# Altium project Rat Social Box Extension.PrjPcb
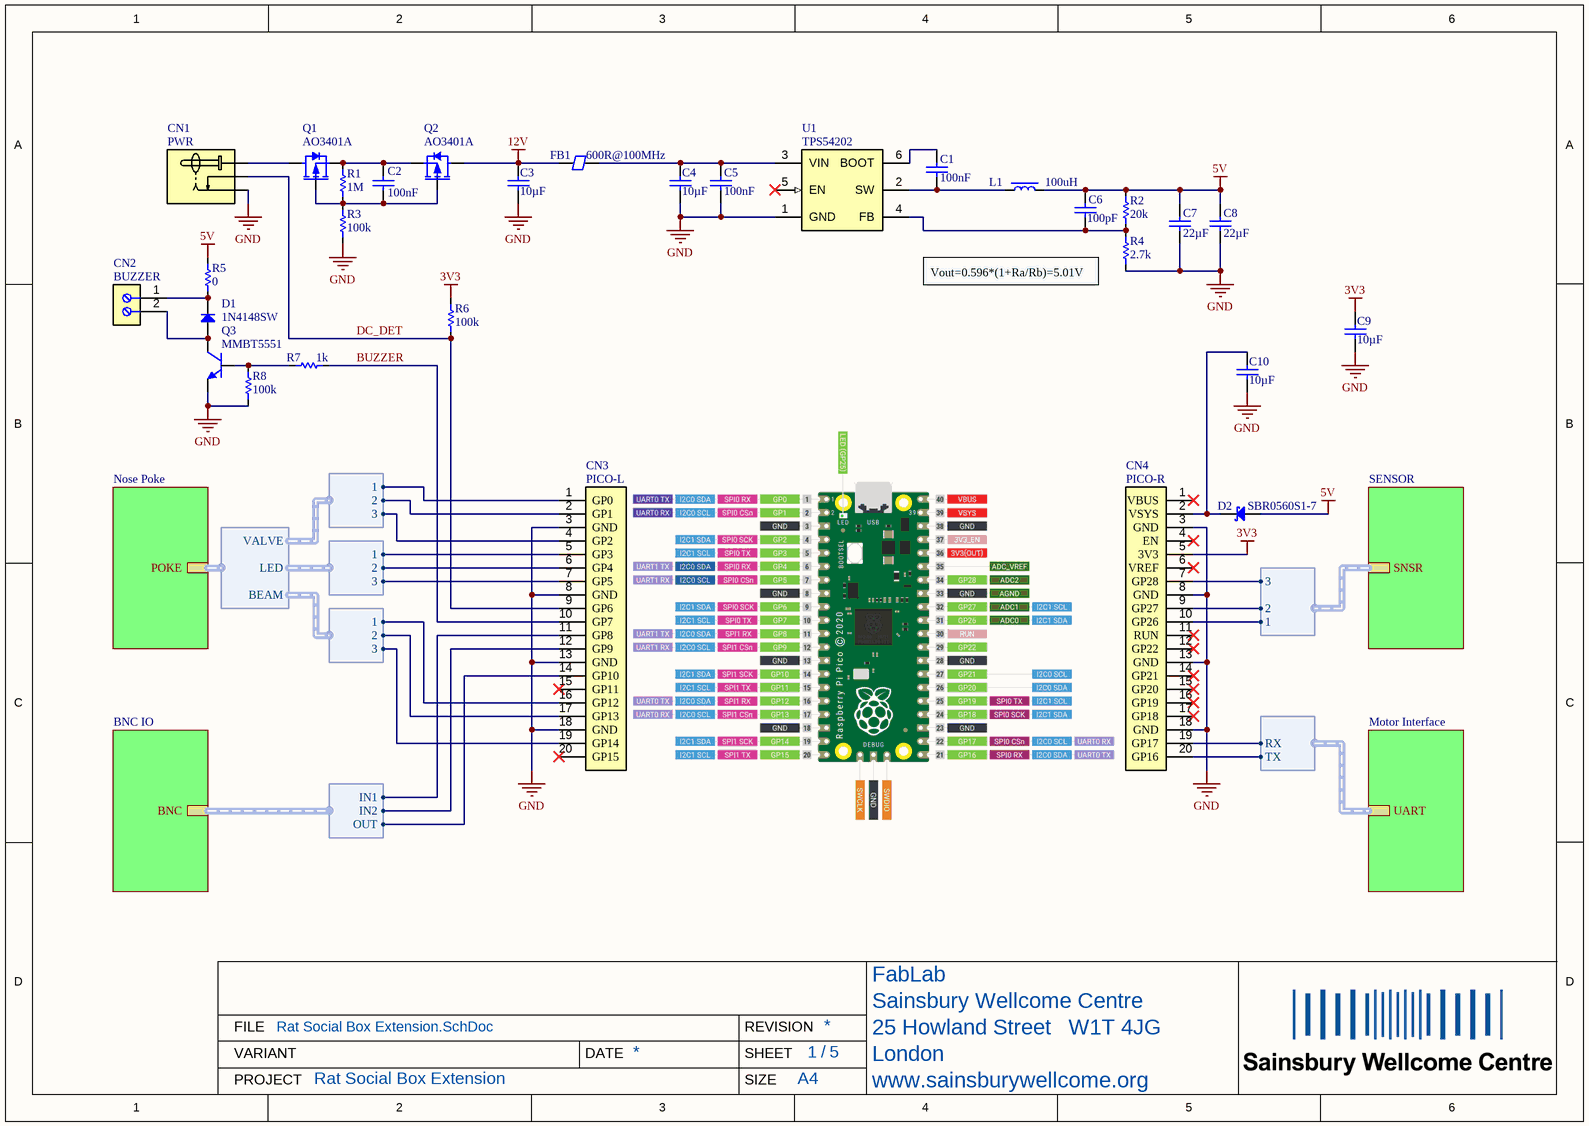
[diagram p0: Rat Social Box Extension.SchDoc]
Project: Rat Social Box Extension
5 sheets, 101 parts. Net scope: hierarchical (ports join the sheet entries above them; power ports are global).
Board file: Rat Social Box Extension.PcbDoc
Sheets:
  Rat Social Box Extension.SchDoc
    SENSOR = Sensor.SchDoc
    Motor Interface = Motor Interface.SchDoc
    Nose Poke = Nose Poke.SchDoc
    BNC IO = BNC IO.SchDoc

## Sheet Rat Social Box Extension.SchDoc
size 297 x 209 mm; CompanyName: Sainsbury Wellcome Centre; Organization: FabLab; Address1: Sainsbury Wellcome Centre; Address2: 25 Howland Street; Address3: London; Address4: W1T 4JG; DocumentNumber: 1; SheetNumber: 1; SheetTotal: 5; swcgroup: FabLab; Org: Sainsbury Wellcome Centre; Add1: 25 Howland Street; Add2: London; Add3: W1T 4JG; WebAddress: www.sainsburywellcome.org; SheetSize: A4; SheetName: Rat Social Box Extension

### Parts
C1  value 100nF  [CAP_CHIP_0603]  (hidden comment: C0603-100nF-50V)
C2  value 100nF  [CAP_CHIP_0603]  (hidden comment: C0603-100nF-50V)
C3  value 10µF  [CAP_CHIP_0603]  (hidden comment: C0603-10uF-25V)
C4  value 10µF  [CAP_CHIP_0603]  (hidden comment: C0603-10uF-25V)
C5  value 100nF  [CAP_CHIP_0603]  (hidden comment: C0603-100nF-50V)
C6  value 100pF  [CAP_CHIP_0603]  (hidden comment: C0603-100pF-50V)
C7  value 22µF  [CAP_CHIP_0603]  (hidden comment: C0603-22uF-6V3)
C8  value 22µF  [CAP_CHIP_0603]  (hidden comment: C0603-22uF-6V3)
C9  value 10µF  [CAP_CHIP_0603]  (hidden comment: C0603-10uF-25V)
C10  value 10µF  [CAP_CHIP_0603]  (hidden comment: C0603-10uF-25V)
CN1  PWR  [DC-005-2.0]
CN2  BUZZER  [TH-5.00-1X2P]
CN3  PICO-L  [FM_2.54_1X20P]
CN4  PICO-R  [FM_2.54_1X20P]
D1  1N4148SW  [SOD323]
D2  SBR0560S1-7  [SOD123]
FB1  value 600R@100MHz  [FB_CHIP_0805]  (hidden comment: FB0805-600R-0.5A)
L1  value 100uH  [IND_PWR_0402L]  (hidden comment: L-PWR-100uH-0.26A)
Q1  AO3401A  [SOT23]
Q2  AO3401A  [SOT23]
Q3  MMBT5551  [SOT23]
R1  value 1M  [RES_CHIP_0603]  (hidden comment: R0603-1M)
R2  value 20k  [RES_CHIP_0603]  (hidden comment: R0603-20K)
R3  value 100k  [RES_CHIP_0603]  (hidden comment: R0603-100K)
R4  value 2.7k  [RES_CHIP_0603]  (hidden comment: R0603-2K7)
R5  value 0  [RES_CHIP_1206]  (hidden comment: R1206-0R)
R6  value 100k  [RES_CHIP_0603]  (hidden comment: R0603-100K)
R7  value 1k  [RES_CHIP_0603]  (hidden comment: R0603-1K)
R8  value 100k  [RES_CHIP_0603]  (hidden comment: R0603-100K)
U1  TPS54202  [SOT23-6]

### Sub-sheets
BNC IO = BNC IO.SchDoc: BNC (harness BNC)
Motor Interface = Motor Interface.SchDoc: UART (harness UART)
Nose Poke = Nose Poke.SchDoc: POKE (harness POKE)
SENSOR = Sensor.SchDoc: SNSR (harness SNSR)

### Harnesses
UART: TX, RX
SNSR: 3, 2, 1
POKE: VALVE, LED, BEAM
VALVE: 1, 2, 3
LED: 1, 2, 3
BEAM: 1, 2, 3
BNC: IN1, IN2, OUT

### Nets
3V3: C9.2 CN4.5(3V3) R6.2
5V: C6.2 C7.2 C8.2 D2.2(A) L1.2 R2.2 R5.2
12V: C3.2 FB1.1 Q2.3(D)
GND: C3.1 C4.1 C5.1 C7.1 C8.1 C9.1 C10.1 CN1.2(Ring) CN3.3(GND) CN3.8(GND) CN3.13(GND) CN3.18(GND) CN4.3(GND) CN4.8(GND) CN4.13(GND) CN4.18(GND) Q3.2(E) R3.1 R4.1 R8.1 U1.1(GND)
BNC.IN1: CN3.11(GP8) ; sheet BNC IO/BNC.IN1
BNC.IN2: CN3.12(GP9) ; sheet BNC IO/BNC.IN2
BNC.OUT: CN3.14(GP10) ; sheet BNC IO/BNC.OUT
BUZZER: CN3.10(GP7) R7.2
DC_DET: CN1.3(Detect) CN3.9(GP6) R6.1
POKE.BEAM.1: CN3.16(GP12) ; harness BEAM.1
POKE.BEAM.2: CN3.17(GP13) ; harness BEAM.2
POKE.BEAM.3: CN3.19(GP14) ; harness BEAM.3
POKE.LED.1: CN3.5(GP3) ; harness LED.1
POKE.LED.2: CN3.6(GP4) ; harness LED.2
POKE.LED.3: CN3.7(GP5) ; harness LED.3
POKE.VALVE.1: CN3.1(GP0) ; harness VALVE.1
POKE.VALVE.2: CN3.2(GP1) ; harness VALVE.2
POKE.VALVE.3: CN3.4(GP2) ; harness VALVE.3
SNSR.1: CN4.10(GP26) ; sheet SENSOR/SNSR.1
SNSR.2: CN4.9(GP27) ; sheet SENSOR/SNSR.2
SNSR.3: CN4.7(GP28) ; sheet SENSOR/SNSR.3
NetC1_1: C1.1 L1.1 U1.2(SW)
NetC1_2: C1.2 U1.6(BOOT)
NetC2_1: C2.1 Q1.1(G) Q2.1(G) R1.1 R3.2
NetC2_2: C2.2 Q1.2(S) Q2.2(S) R1.2
NetC4_2: C4.2 C5.2 FB1.2 U1.3(VIN)
NetC6_1: C6.1 R2.1 R4.2 U1.4(FB)
NetC10_2: C10.2 CN4.2(VSYS) D2.1(C)
NetCN1_1: CN1.1(Center) Q1.3(D)
NetCN2_1: CN2.1 D1.1(K) R5.1
NetCN2_2: CN2.2 D1.2(A) Q3.3(C)
NetCN4_19: CN4.19(GP17) ; sheet Motor Interface/UART.RX
NetCN4_20: CN4.20(GP16) ; sheet Motor Interface/UART.TX
NetQ3_1: Q3.1(B) R7.1 R8.2

Not connected (* = marked no-connect by the designer): CN3 15(GP11)* 20(GP15)*; CN4 1(VBUS)* 4(EN)* 6(VREF)* 11(RUN)* 12(GP22)* 14(GP21)* 15(GP20)* 16(GP19)* 17(GP18)*; U1 5(EN)*

### Notes on the sheet
- Vout=0.596*(1+Ra/Rb)=5.01V
- FILE
- VARIANT
- DATE
- REVISION
- SHEET
- /
- PROJECT
- SIZE

### Library data of the parts
C1 C5 = CMP-611-0027-24: 0603 Multilayer Ceramic Capacitors MLCC; PartNumber: CC0603KRX7R9BB104; Tolerance: 10%; Pick&PlaceFootprint: C0603; Dielectric: X7R; Voltage Rating: 50V; Capacitor Type: Ceramic; RoHS: Yes; Mount: SMD; LCSC Part N.: C14663; Case/Package: 0603
C2 = CMP-611-0027-24: 0603 Multilayer Ceramic Capacitors MLCC; PartNumber: CC0603KRX7R9BB104; Pick&PlaceFootprint: C0603; Dielectric: X7R; Voltage Rating: 50V; Tolerance: 10%; Case/Package: 0603; Capacitor Type: Ceramic; LCSC Part N.: C14663; Mount: SMD; RoHS: Yes
C3 C4 C9 C10 = CMP-611-0050-6: 0603 Multilayer Ceramic Capacitors MLCC; PartNumber: CL10A106MA8NRNC; Dielectric: X5R; Pick&PlaceFootprint: C0603; Voltage Rating: 25V; Tolerance: 20%; Case/Package: 0603; LCSC Part N.: C96446; RoHS: Yes; Capacitor Type: Ceramic; Mount: SMD
C6 = CMP-611-0038-6: 0603 Multilayer Ceramic Capacitors MLCC; PartNumber: CL10C101JB8NNNC; Pick&PlaceFootprint: C0603; Tolerance: 5%; Voltage Rating: 50V; Dielectric: C0G; Case/Package: 0603; LCSC Part N.: C14858; Capacitor Type: Ceramic; Mount: SMD; RoHS: Yes
C7 C8 = CMP-611-0054-4: 0603 Multilayer Ceramic Capacitors MLCC; PartNumber: CL10A226MQ8NRNC; Pick&PlaceFootprint: C0603; Dielectric: X5R; Voltage Rating: 6.3V; Tolerance: 20%; RoHS: Yes; Mount: SMD; Case/Package: 0603; Capacitor Type: Ceramic; LCSC Part N.: C59461
CN1 = CMP-360-0005-6: Surface Mount, Right Angle 2.5A 24V SMD DC Power Connector; PartNumber: DC-005-2.5A-2.0-SMT; Connector Type: Jack,Power; Pitch: 2.0mm; Gender: Male; Contact Plating: Tin; Voltage Rating: 24V; Contact Material: Copper Alloy; Current Rating: 2.5A; Mount: Surface Mount; LCSC Part N.: C2880543; Orientation: Horizontal
CN2 = CMP-00028-6: 1x2P 20A -40℃~+105℃ 250V Green 12~22 Direct Insert 5mm 2.5 1 2 Plugin,P=5mm Screw Terminal Blocks; PartNumber: WJ128V-5.0-2P; Gender: Male; Number of Positions: 2; Number of Rows: 1; LCSC Part N.: C8269; Pitch: 5mm; Mount: Thought Hole; Number of Contacts: 2; Orientation: Straight
CN3 CN4 = CMP-380-0017-2: 8.5mm Square Hole TH,P=2.54mm Female Headers; PartNumber: 22850120ANG1SYA01; Pitch: 2.54mm; Number of Positions: 20; Orientation: Straight; Gender: Female; Number of Contacts: 20; Number of Rows: 1; Mount: TH; LCSC Part N.: C429947
D1 = CMP-820-0007-2: 100V Single 1.25V@150mA 4ns 150mA SOD-323 Switching Diode; Forward Voltage: 1.25V; Mount: Surface Mount; Max Reverse Voltage: 100V; Pick&PlaceFootprint: SOD-323; Rectified Current: 150mA; LCSC Part N.: C2128; PartNumber: 1N4148SW
D2 = CMP-821-0014-2: Diode Schottky 60V 0.5A 2-Pin SOD-123 T/R; Rectified Current: 15A; Forward Voltage: 440mV; PartNumber: SBR0560S1-7; LCSC Part N.: C117950; Mount: Surface Mount; Max Reverse Voltage: 60V; Pick&PlaceFootprint: SOD123
FB1 = CMP-600-0000-6: Ferrite Chip, 1 Function(s), 0.5A, 2 Pin(s); PartNumber: GZ2012D601TF; DC Resistance-Max: 300mR; Current Rating: 500mA; Footprint: 0805; LCSC Part N.: C1017
L1 = CMP-620-0008-4: Inductor Power Shielded Wirewound 100uH 20% 100KHz Ferrite 450mA DCR 1515 Blister T/R; PartNumber: VLCF4020T-101MR26; Saturation Current: 260mA; DC Resistance (DCR): 1R4; LCSC Part N.: C20339; Tolerance: 20%; RMS Current (Irms): 450mA
Q1 Q2 = CMP-810-0003-2: 30V 4A 44mΩ@10V,4.3A 1.4W 1.3V@250uA 1 PChannel SOT-23-3L MOSFETs; RDS(ON): 44mR; Gate-Source Voltage (Vgs): 12V; Pick&PlaceFootprint: SOT-23; Drain Current (Id): -4A; Switching Time: 60ns; Drain-Source Voltage (Vds): -30V; Polarity: P Channel; Power Dissipation: 1.4W; LCSC Part N.: C15127; Mount: Surface Mount; PartNumber: AO3401A
Q3 = CMP-810-0000-7: 160V 300mW 200@10mA 5V 600mA NPN SOT-23 Bipolar Transistor; Collector-Base Voltage (VCBO): 180V; Transition Frequency: 100MHz; Emitter-Base Voltage  (VEBO): 6V; Power Dissipation: 300mW; Polarity: NPN; PartNumber: MMBT5551; Pick&PlaceFootprint: SOT-23; Collector Current (IC): 600mA; Mount: Surface Mount; LCSC Part N.: C2145; Collector-Emitter Voltage( VCEO): 160V
R1 = CMP-633-0066-20: 100mW Thick Film Resistors 75V ±100ppm/℃ ±1% 0603 Chip Resistor; PartNumber: 0603WAF1004T5E; Number of Resistors: 1; Pick&PlaceFootprint: R0603; Voltage Rating: 75V; Mount: Surface Mount; LCSC Part N.: C22935; Power Rating: 100mW; Tolerance: 1%; Case/Package: 0603
R2 = CMP-633-0126-1: 100mW Thick Film Resistors 75V ±100ppm/℃ ±1% 0603 Chip Resistor; PartNumber: 0603WAF2002T5E; Pick&PlaceFootprint: R0603; Number of Resistors: 1; Case/Package: 0603; Tolerance: 1%; Voltage Rating: 75V; Power Rating: 100mW; Mount: Surface Mount; LCSC Part N.: C4184
R3 R6 R8 = CMP-633-0000-28: 100mW Thick Film Resistors 75V ±100ppm/℃ ±1% 0603 Chip Resistor; PartNumber: 0603WAF1003T5E; Number of Resistors: 1; Pick&PlaceFootprint: R0603; LCSC Part N.: C25803; Mount: Surface Mount; Voltage Rating: 75V; Power Rating: 100mW; Case/Package: 0603; Tolerance: 1%
R4 = CMP-633-0031-25: 100mW Thick Film Resistors 75V ±100ppm/℃ ±1% 0603 Chip Resistor; PartNumber: 0603WAF2701T5E; Number of Resistors: 1; Pick&PlaceFootprint: R0603; Mount: Surface Mount; Power Rating: 100mW; Case/Package: 0603; Tolerance: 1%; Voltage Rating: 75V; LCSC Part N.: C13167
R5 = CMP-633-0050-10: 250mW Thick Film Resistors 200V ±800ppm/℃ ±1% 0Ω 1206 Chip Resistor; PartNumber: 1206W4F0000T5E; Number of Resistors: 1; Pick&PlaceFootprint: 1206; Tolerance: 1%; Power Rating: 250mW; Case/Package: 1206; Voltage Rating: 200V; LCSC Part N.: C17888; Mount: Surface Mount
R7 = CMP-633-0013-26: 100mW Thick Film Resistors 75V ±100ppm/℃ ±1% 0603 Chip Resistor; PartNumber: 0603WAF1001T5E; Pick&PlaceFootprint: R0603; Number of Resistors: 1; Voltage Rating: 75V; Case/Package: 0603; Tolerance: 1%; Mount: Surface Mount; LCSC Part N.: C21190; Power Rating: 100mW
U1 = CMP-970-0042-1: Switching Regulator, Current-mode, 2A, 500kHz Switching Freq-Max, PDSO6; PartNumber: TPS54202DDCR; Load Regulation: 0.1%; Max Output Voltage: 28V; Min Input Voltage: 4.5V; Switcher Configuration: BUCK; RDS(On): 148mR; Switching Frequency: 590kHz; Reference Voltage: 0.596V; Pick&PlaceFootprint: SOT23-6; Max Input Voltage: 28V; LCSC Part N.: C191884; Line Regulation: 0.1%; Max Output current: 2A

## Sheet Sensor.SchDoc
size 297 x 209 mm; CompanyName: Sainsbury Wellcome Centre; Organization: FabLab; Address1: Sainsbury Wellcome Centre; Address2: 25 Howland Street; Address3: London; Address4: W1T 4JG; DocumentNumber: 3; SheetNumber: 4; SheetTotal: 5; swcgroup: FabLab; Org: Sainsbury Wellcome Centre; Add1: 25 Howland Street; Add2: London; Add3: W1T 4JG; WebAddress: www.sainsburywellcome.org; SheetSize: A4; SheetName: Sensor
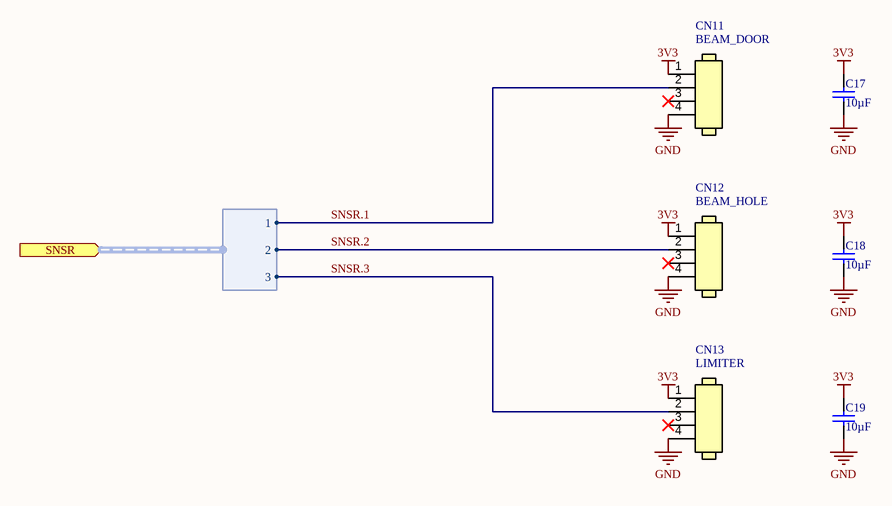
[diagram p1: Sensor.SchDoc]

### Parts
C17  value 10µF  [CAP_CHIP_0603]  (hidden comment: C0603-10uF-25V)
C18  value 10µF  [CAP_CHIP_0603]  (hidden comment: C0603-10uF-25V)
C19  value 10µF  [CAP_CHIP_0603]  (hidden comment: C0603-10uF-25V)
CN11  BEAM_DOOR  [MOLEX_1.25_R_DIP_4P]
CN12  BEAM_HOLE  [MOLEX_1.25_R_DIP_4P]
CN13  LIMITER  [MOLEX_1.25_R_DIP_4P]

### Ports
SNSR (in, harness SNSR)

### Harnesses
SNSR: 3, 2, 1

### Nets
3V3: C17.2 C18.2 C19.2 CN11.1 CN12.1 CN13.1
GND: C17.1 C18.1 C19.1 CN11.4 CN12.4 CN13.4
SNSR.1: CN11.2 ; port SNSR.1
SNSR.2: CN12.2 ; port SNSR.2
SNSR.3: CN13.2 ; port SNSR.3

Not connected (* = marked no-connect by the designer): CN11 3*; CN12 3*; CN13 3*

### Notes on the sheet
- FILE
- VARIANT
- DATE
- REVISION
- SHEET
- /
- PROJECT
- SIZE

### Library data of the parts
C17-C19 = CMP-611-0050-6: as C3 on sheet Rat Social Box Extension; Case/Package: 0603; LCSC Part N.: C96446; RoHS: Yes; Capacitor Type: Ceramic; Mount: SMD
CN11-CN13 = CMP-370-0050-2: Conn Shrouded Header (4 Sides) HDR 4 POS 1.25mm Solder RA Side Entry Thru-Hole PicoBlade™ Tray; PartNumber: 53048-0410; Number of Contacts: 4; Current Rating: 1A; Gender: Male; Pitch: 1.25mm; Orientation: Right Angle; Number of Rows: 1; Mount: Surface Mount; LCSC Part N.: C588275

## Sheet Motor Interface.SchDoc
size 297 x 209 mm; CompanyName: Sainsbury Wellcome Centre; Organization: FabLab; Address1: Sainsbury Wellcome Centre; Address2: 25 Howland Street; Address3: London; Address4: W1T 4JG; DocumentNumber: 5; SheetNumber: 5; SheetTotal: 5; swcgroup: FabLab; Org: Sainsbury Wellcome Centre; Add1: 25 Howland Street; Add2: London; Add3: W1T 4JG; WebAddress: www.sainsburywellcome.org; SheetSize: A4; SheetName: Motor Interface
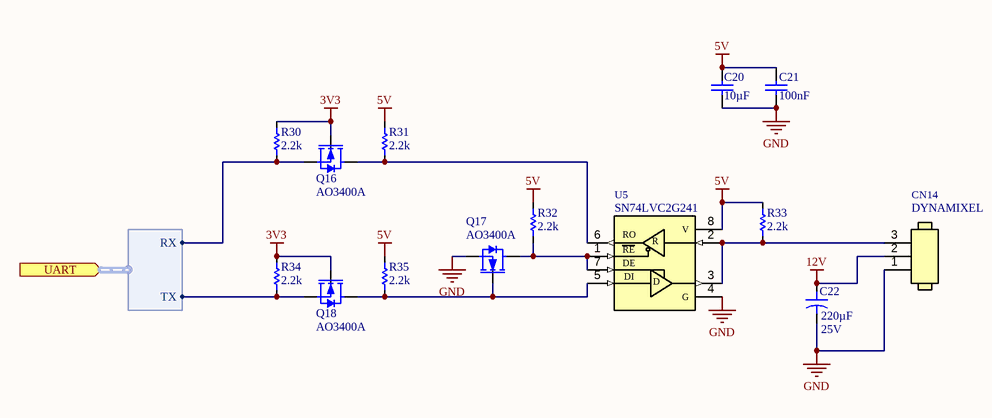
[diagram p2: Motor Interface.SchDoc]

### Parts
C20  value 10µF  [CAP_CHIP_0603]  (hidden comment: C0603-10uF-25V)
C21  value 100nF  [CAP_CHIP_0603]  (hidden comment: C0603-100nF-50V)
C22  value 220µF  Voltage Rating: 25V  [ECAP_SMD_6.3]  (hidden comment: SC63-220uF-25V)
CN14  DYNAMIXEL  [EH_90_1X3P]
Q16  AO3400A  [SOT23]
Q17  AO3400A  [SOT23]
Q18  AO3400A  [SOT23]
R30  value 2.2k  [RES_CHIP_0603]  (hidden comment: R0603-2K2)
R31  value 2.2k  [RES_CHIP_0603]  (hidden comment: R0603-2K2)
R32  value 2.2k  [RES_CHIP_0603]  (hidden comment: R0603-2K2)
R33  value 2.2k  [RES_CHIP_0603]  (hidden comment: R0603-2K2)
R34  value 2.2k  [RES_CHIP_0603]  (hidden comment: R0603-2K2)
R35  value 2.2k  [RES_CHIP_0603]  (hidden comment: R0603-2K2)
U5  SN74LVC2G241  [VSSOP8_2X2.3_0.5E]

### Ports
UART (in, harness UART)

### Harnesses
UART: TX, RX

### Nets
3V3: Q16.1(G) Q18.1(G) R30.2 R34.2
5V: C20.2 C21.2 R31.2 R32.2 R33.2 R35.2 U5.8(V)
12V: C22.1 CN14.2
GND: C20.1 C21.1 C22.2 CN14.1 Q17.2(S) U5.4(G)
NetCN4_19: Q16.2(S) R30.1 ; port UART.RX
NetCN4_20: Q18.2(S) R34.1 ; port UART.TX
NetCN14_3: CN14.3 R33.1 U5.2(1A) U5.3(B)
NetQ16_3: Q16.3(D) R31.1 U5.6(1Y)
NetQ17_1: Q17.1(G) Q18.3(D) R35.1 U5.5(D)
NetQ17_3: Q17.3(D) R32.1 U5.1(~{1OE}) U5.7(2OE)

### Notes on the sheet
- FILE
- VARIANT
- DATE
- REVISION
- SHEET
- /
- PROJECT
- SIZE
- (in symbol CMP-9C0-0006-1) RO; R; RE; DE; DI

### Library data of the parts
C20 = CMP-611-0050-6: as C3 on sheet Rat Social Box Extension; Case/Package: 0603; LCSC Part N.: C96446; RoHS: Yes; Capacitor Type: Ceramic; Mount: SMD
C21 = CMP-611-0027-24: as C1 on sheet Rat Social Box Extension; Capacitor Type: Ceramic; RoHS: Yes; Mount: SMD; LCSC Part N.: C14663; Case/Package: 0603
C22 = CMP-610-0003-4: 25V 220uF ±20% SMD,D6.3xL7.7mm Solid Capacitors; PartNumber: HV1E477M0810PZ; Pick&PlaceFootprint: EC63; ESR (Equivalent Series Resistance): 35mR; Mount: Surface Mount; RoHS: Yes; Capacitor Type: Solid; LCSC Part N.: C5246541; Tolerance: 20%
CN14 = CMP-370-0057-1: Conn Shrouded Header (3 Sides) HDR 3 POS 2.5mm Solder RA Side Entry Thru-Hole Box; PartNumber: S3B-EH(LF)(SN); Gender: Male; Number of Positions: 3; Current Rating: 3A; Mount: through hole; Orientation: Right Angle; LCSC Part N.: C263754; Pitch: 2.5mm; Contact Plating: Tin; Number of Rows: 1; Contact Material: Copper, Tin; Number of Contacts: 3
Q16-Q18 = CMP-810-0002-2: 30V 5.7A 26.5mΩ@10V,5.7A 1.4W 1.5V@250uA 1 NChannel SOT-23-3L MOSFETs; Gate-Source Voltage (Vgs): 12V; Pick&PlaceFootprint: SOT-23; RDS(ON): 26.5mR; Switching Time: 34.5ns; LCSC Part N.: C20917; Drain-Source Voltage (Vds): 30V; Mount: Surface Mount; PartNumber: AO3400A; Power Dissipation: 1.4W; Drain Current (Id): 5.7A; Polarity: N Channel
R30-R35 = CMP-633-0070-21: 100mW Thick Film Resistors 75V ±100ppm/℃ ±1% 0603 Chip Resistor; PartNumber: 0603WAF2201T5E; Pick&PlaceFootprint: R0603; Number of Resistors: 1; Power Rating: 100mW; Mount: Surface Mount; Voltage Rating: 75V; Tolerance: 1%; LCSC Part N.: C4190; Case/Package: 0603
U5 = CMP-9C0-0006-1: Buffer/Line Driver 2-CH Non-Inverting 3-ST CMOS 8-Pin VSSOP T/R; PartNumber: SN74LVC2G241DCUR; Max Supply Voltage: 5.5V; Number of Channels: 2; Low Level Output Current: 32mA; Min Supply Voltage: 1.65V; Turn-On Delay Time: 12.5ns; Pick&PlaceFootprint: VSSOP8; High Level Output Current: -32mA; LCSC Part N.: C10430

## Sheet Nose Poke.SchDoc
size 297 x 209 mm; CompanyName: Sainsbury Wellcome Centre; Organization: FabLab; Address1: Sainsbury Wellcome Centre; Address2: 25 Howland Street; Address3: London; Address4: W1T 4JG; DocumentNumber: 2; SheetNumber: 3; SheetTotal: 5; swcgroup: FabLab; Org: Sainsbury Wellcome Centre; Add1: 25 Howland Street; Add2: London; Add3: W1T 4JG; WebAddress: www.sainsburywellcome.org; SheetSize: A4; SheetName: Nose Poke
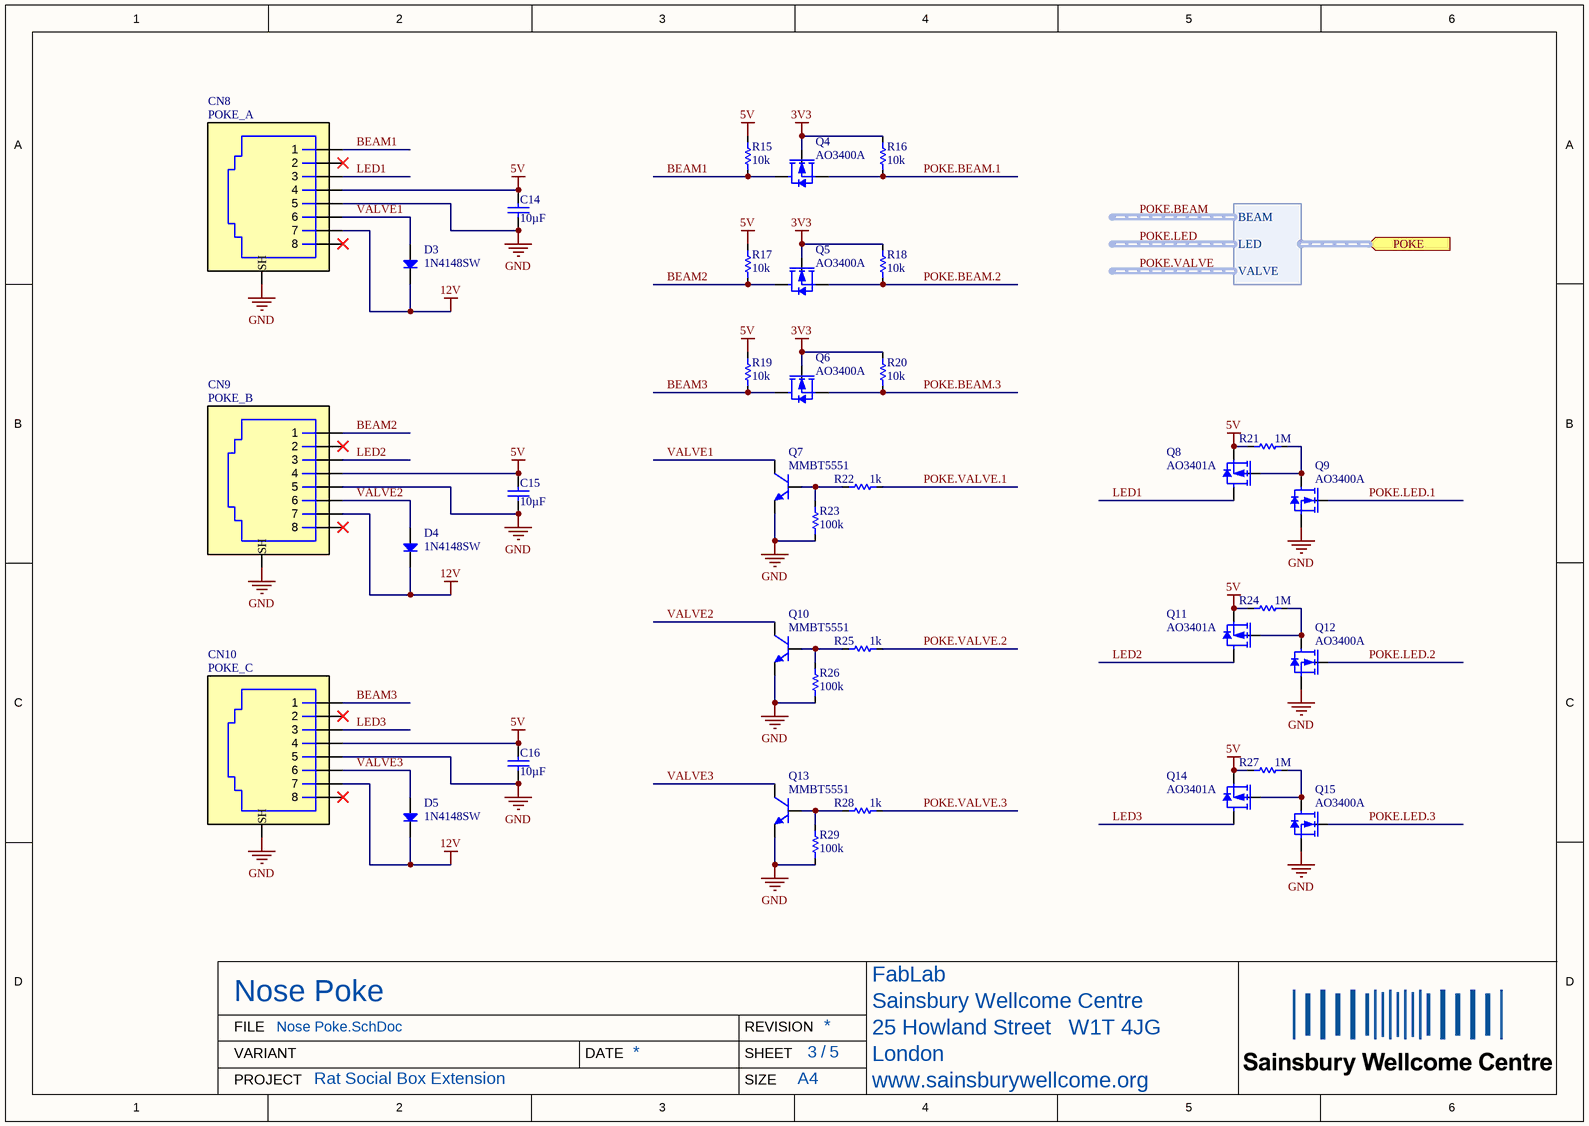
[diagram p3: Nose Poke.SchDoc]

### Parts
C14  value 10µF  [CAP_CHIP_0603]  (hidden comment: C0603-10uF-25V)
C15  value 10µF  [CAP_CHIP_0603]  (hidden comment: C0603-10uF-25V)
C16  value 10µF  [CAP_CHIP_0603]  (hidden comment: C0603-10uF-25V)
CN8  POKE_A  [6339160-1]
CN9  POKE_B  [6339160-1]
CN10  POKE_C  [6339160-1]
D3  1N4148SW  [SOD323]
D4  1N4148SW  [SOD323]
D5  1N4148SW  [SOD323]
Q4  AO3400A  [SOT23]
Q5  AO3400A  [SOT23]
Q6  AO3400A  [SOT23]
Q7  MMBT5551  [SOT23]
Q8  AO3401A  [SOT23]
Q9  AO3400A  [SOT23]
Q10  MMBT5551  [SOT23]
Q11  AO3401A  [SOT23]
Q12  AO3400A  [SOT23]
Q13  MMBT5551  [SOT23]
Q14  AO3401A  [SOT23]
Q15  AO3400A  [SOT23]
R15  value 10k  [RES_CHIP_0603]  (hidden comment: R0603-10K)
R16  value 10k  [RES_CHIP_0603]  (hidden comment: R0603-10K)
R17  value 10k  [RES_CHIP_0603]  (hidden comment: R0603-10K)
R18  value 10k  [RES_CHIP_0603]  (hidden comment: R0603-10K)
R19  value 10k  [RES_CHIP_0603]  (hidden comment: R0603-10K)
R20  value 10k  [RES_CHIP_0603]  (hidden comment: R0603-10K)
R21  value 1M  [RES_CHIP_0603]  (hidden comment: R0603-1M)
R22  value 1k  [RES_CHIP_0603]  (hidden comment: R0603-1K)
R23  value 100k  [RES_CHIP_0603]  (hidden comment: R0603-100K)
R24  value 1M  [RES_CHIP_0603]  (hidden comment: R0603-1M)
R25  value 1k  [RES_CHIP_0603]  (hidden comment: R0603-1K)
R26  value 100k  [RES_CHIP_0603]  (hidden comment: R0603-100K)
R27  value 1M  [RES_CHIP_0603]  (hidden comment: R0603-1M)
R28  value 1k  [RES_CHIP_0603]  (hidden comment: R0603-1K)
R29  value 100k  [RES_CHIP_0603]  (hidden comment: R0603-100K)

### Ports
POKE (in, harness POKE)

### Harnesses
POKE: VALVE, LED, BEAM

### Nets
3V3: Q4.1(G) Q5.1(G) Q6.1(G) R16.2 R18.2 R20.2
5V: C14.2 C15.2 C16.2 CN8.4 CN9.4 CN10.4 Q8.2(S) Q11.2(S) Q14.2(S) R15.2 R17.2 R19.2 R21.2 R24.2 R27.2
12V: CN8.7 CN9.7 CN10.7 D3.1(K) D4.1(K) D5.1(K)
GND: C14.1 C15.1 C16.1 CN8.0(SH) CN8.5 CN9.0(SH) CN9.5 CN10.0(SH) CN10.5 Q7.2(E) Q9.2(S) Q10.2(E) Q12.2(S) Q13.2(E) Q15.2(S) R23.1 R26.1 R29.1
BEAM1: CN8.1 Q4.3(D) R15.1
BEAM2: CN9.1 Q5.3(D) R17.1
BEAM3: CN10.1 Q6.3(D) R19.1
LED1: CN8.3 Q8.3(D)
LED2: CN9.3 Q11.3(D)
LED3: CN10.3 Q14.3(D)
POKE.BEAM.1: Q4.2(S) R16.1
POKE.BEAM.2: Q5.2(S) R18.1
POKE.BEAM.3: Q6.2(S) R20.1
POKE.LED.1: Q9.1(G)
POKE.LED.2: Q12.1(G)
POKE.LED.3: Q15.1(G)
POKE.VALVE.1: R22.2
POKE.VALVE.2: R25.2
POKE.VALVE.3: R28.2
VALVE1: CN8.6 D3.2(A) Q7.3(C)
VALVE2: CN9.6 D4.2(A) Q10.3(C)
VALVE3: CN10.6 D5.2(A) Q13.3(C)
NetQ7_1: Q7.1(B) R22.1 R23.2
NetQ8_1: Q8.1(G) Q9.3(D) R21.1
NetQ10_1: Q10.1(B) R25.1 R26.2
NetQ11_1: Q11.1(G) Q12.3(D) R24.1
NetQ13_1: Q13.1(B) R28.1 R29.2
NetQ14_1: Q14.1(G) Q15.3(D) R27.1

Not connected (* = marked no-connect by the designer): CN8 2* 8*; CN9 2* 8*; CN10 2* 8*

### Notes on the sheet
- FILE
- VARIANT
- DATE
- REVISION
- SHEET
- /
- PROJECT
- SIZE

### Library data of the parts
C14-C16 = CMP-611-0050-6: as C3 on sheet Rat Social Box Extension; Case/Package: 0603; LCSC Part N.: C96446; RoHS: Yes; Capacitor Type: Ceramic; Mount: SMD
CN8-CN10 = CMP-390-0000-8: CONN MOD JACK 8P8C R/A SHIELDED; Number of Contacts: 8; Pitch: 1.02mm; Element Configuration: Single; Gender: Female; LCSC Part N.: C125076; Orientation: Right Angle; PartNumber: 6339160-1; Termination: SMD/SMT; Shielding: Shielded
D3-D5 = CMP-820-0007-2: as D1 on sheet Rat Social Box Extension; Mount: Surface Mount; Max Reverse Voltage: 100V; Pick&PlaceFootprint: SOD-323; Rectified Current: 150mA; LCSC Part N.: C2128; PartNumber: 1N4148SW
Q4-Q6 Q9 Q12 Q15 = CMP-810-0002-2: as Q16 on sheet Motor Interface; LCSC Part N.: C20917; Drain-Source Voltage (Vds): 30V; Mount: Surface Mount; PartNumber: AO3400A; Power Dissipation: 1.4W; Drain Current (Id): 5.7A; Polarity: N Channel
Q7 Q10 Q13 = CMP-810-0000-7: as Q3 on sheet Rat Social Box Extension; Power Dissipation: 300mW; Polarity: NPN; PartNumber: MMBT5551; Pick&PlaceFootprint: SOT-23; Collector Current (IC): 600mA; Mount: Surface Mount; LCSC Part N.: C2145; Collector-Emitter Voltage( VCEO): 160V
Q8 Q11 Q14 = CMP-810-0003-2: as Q1 on sheet Rat Social Box Extension; Polarity: P Channel; Power Dissipation: 1.4W; LCSC Part N.: C15127; Mount: Surface Mount; PartNumber: AO3401A
R15-R20 = CMP-633-0002-26: 100mW Thick Film Resistors 75V ±100ppm/℃ ±1% 0603 Chip Resistor; PartNumber: 0603WAF1002T5E; Number of Resistors: 1; Pick&PlaceFootprint: R0603; Case/Package: 0603; Voltage Rating: 75V; Power Rating: 100mW; LCSC Part N.: C25804; Tolerance: 1%; Mount: Surface Mount
R21 R24 R27 = CMP-633-0066-20: as R1 on sheet Rat Social Box Extension; Voltage Rating: 75V; Mount: Surface Mount; LCSC Part N.: C22935; Power Rating: 100mW; Tolerance: 1%; Case/Package: 0603
R22 R25 R28 = CMP-633-0013-26: as R7 on sheet Rat Social Box Extension; Voltage Rating: 75V; Case/Package: 0603; Tolerance: 1%; Mount: Surface Mount; LCSC Part N.: C21190; Power Rating: 100mW
R23 R26 R29 = CMP-633-0000-28: as R3 on sheet Rat Social Box Extension; LCSC Part N.: C25803; Mount: Surface Mount; Voltage Rating: 75V; Power Rating: 100mW; Case/Package: 0603; Tolerance: 1%

## Sheet BNC IO.SchDoc
size 297 x 209 mm; CompanyName: Sainsbury Wellcome Centre; Organization: FabLab; Address1: Sainsbury Wellcome Centre; Address2: 25 Howland Street; Address3: London; Address4: W1T 4JG; DocumentNumber: 6; SheetNumber: 2; SheetTotal: 5; swcgroup: FabLab; Org: Sainsbury Wellcome Centre; Add1: 25 Howland Street; Add2: London; Add3: W1T 4JG; WebAddress: www.sainsburywellcome.org; SheetSize: A4; SheetName: BNC IO
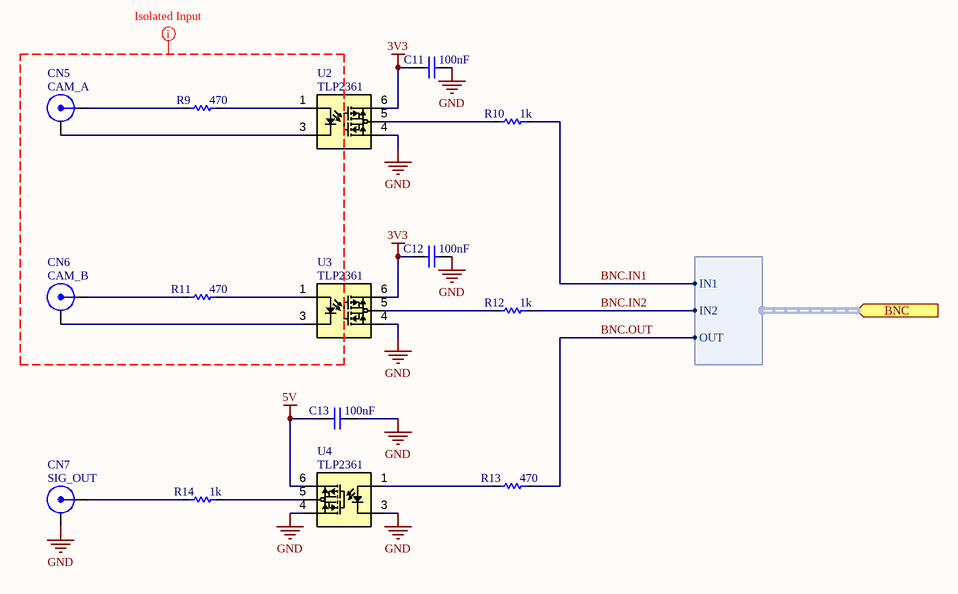
[diagram p4: BNC IO.SchDoc]

### Parts
C11  value 100nF  [CAP_CHIP_0603]  (hidden comment: C0603-100nF-50V)
C12  value 100nF  [CAP_CHIP_0603]  (hidden comment: C0603-100nF-50V)
C13  value 100nF  [CAP_CHIP_0603]  (hidden comment: C0603-100nF-50V)
CN5  CAM_A  [BNC-MOLEX-731000105]
CN6  CAM_B  [BNC-MOLEX-731000105]
CN7  SIG_OUT  [BNC-MOLEX-731000105]
R9  value 470  [RES_CHIP_0603]  (hidden comment: R0603-470R)
R10  value 1k  [RES_CHIP_0603]  (hidden comment: R0603-1K)
R11  value 470  [RES_CHIP_0603]  (hidden comment: R0603-470R)
R12  value 1k  [RES_CHIP_0603]  (hidden comment: R0603-1K)
R13  value 470  [RES_CHIP_0603]  (hidden comment: R0603-470R)
R14  value 1k  [RES_CHIP_0603]  (hidden comment: R0603-1K)
U2  TLP2361  [SO5]
U3  TLP2361  [SO5]
U4  TLP2361  [SO5]

### Ports
BNC (in, harness BNC)

### Harnesses
BNC: IN1, IN2, OUT

### Nets
3V3: C11.2 C12.2 U2.6(VCC) U3.6(VCC)
5V: C13.2 U4.6(VCC)
GND: C11.1 C12.1 C13.1 CN7.2(GND) U2.4(GND) U3.4(GND) U4.3(Cathode) U4.4(GND)
BNC.IN1: R10.2 ; port BNC.IN1
BNC.IN2: R12.2 ; port BNC.IN2
BNC.OUT: R13.2 ; port BNC.OUT
NetCN5_1: CN5.1(SIG) R9.1
NetCN5_2: CN5.2(GND) U2.3(Cathode)
NetCN6_1: CN6.1(SIG) R11.1
NetCN6_2: CN6.2(GND) U3.3(Cathode)
NetCN7_1: CN7.1(SIG) R14.1
NetR9_2: R9.2 U2.1(Anode)
NetR10_1: R10.1 U2.5(Vo)
NetR11_2: R11.2 U3.1(Anode)
NetR12_1: R12.1 U3.5(Vo)
NetR13_1: R13.1 U4.1(Anode)
NetR14_2: R14.2 U4.5(Vo)

### Layout directives
mark named Isolated Input: (no net found under the mark)

### Notes on the sheet
- FILE
- VARIANT
- DATE
- REVISION
- SHEET
- /
- PROJECT
- SIZE

### Library data of the parts
C11-C13 = CMP-611-0027-24: as C1 on sheet Rat Social Box Extension; Capacitor Type: Ceramic; RoHS: Yes; Mount: SMD; LCSC Part N.: C14663; Case/Package: 0603
CN5-CN7 = CMP-730-0012-1: 50 Ohms, BNC Right-Angle PCB Jack Receptacle, Nickel Plated Zinc Alloy Body, Low Profile; PartNumber: 731000105; Gender: Female; Impedance: 50Ω; Voltage Rating: 500V; Clock Frequency: 4GHz; Insertion Loss (dB): 0.2dB; LCSC Part N.: C3174924; Mount: Surface Mount; Contact Material: Gold; Contact Plating: Gold; Body Plating: Nickel; Orientation: Right Angle; Termination: Solder
R9 R11 R13 = CMP-633-0020-24: 100mW Thick Film Resistors 75V ±100ppm/℃ ±1% 0603 Chip Resistor; PartNumber: 0603WAF4700T5E; Pick&PlaceFootprint: R0603; Number of Resistors: 1; Voltage Rating: 75V; Power Rating: 100mW; LCSC Part N.: C23179; Case/Package: 0603; Tolerance: 1%; Mount: Surface Mount
R10 R12 R14 = CMP-633-0013-26: as R7 on sheet Rat Social Box Extension; Voltage Rating: 75V; Case/Package: 0603; Tolerance: 1%; Mount: Surface Mount; LCSC Part N.: C21190; Power Rating: 100mW
U2-U4 = CMP-530-0005-1: Logic IC Output Optocoupler, 1-Channel, 1-Element, 3750V Isolation, 20MBps; PartNumber: TLP2361(TPL,E(T; Forward Voltage: 1.5V; Propagation Delay: 80ns; Direction: Unidirectional; Fall Time: 3ns; Forward Current: 10mA; LCSC Part N.: C107626; Output Current per Channel: 10mA

## Nets that join several sheets
3V3: Rat Social Box Extension (C9.2 CN4.5 R6.2), Sensor (6 pins), Motor Interface (Q16.1 Q18.1 R30.2 R34.2), Nose Poke (6 pins), BNC IO (C11.2 C12.2 U2.6 U3.6)
5V: Rat Social Box Extension (7 pins), Motor Interface (7 pins), Nose Poke (15 pins), BNC IO (C13.2 U4.6)
12V: Rat Social Box Extension (C3.2 FB1.1 Q2.3), Motor Interface (C22.1 CN14.2), Nose Poke (6 pins)
GND: Rat Social Box Extension (21 pins), Sensor (6 pins), Motor Interface (6 pins), Nose Poke (18 pins), BNC IO (8 pins)
BNC.IN1: Rat Social Box Extension (CN3.11), BNC IO (R10.2)
BNC.IN2: Rat Social Box Extension (CN3.12), BNC IO (R12.2)
BNC.OUT: Rat Social Box Extension (CN3.14), BNC IO (R13.2)
NetCN4_19: Rat Social Box Extension (CN4.19), Motor Interface (Q16.2 R30.1)
NetCN4_20: Rat Social Box Extension (CN4.20), Motor Interface (Q18.2 R34.1)
SNSR.1: Rat Social Box Extension (CN4.10), Sensor (CN11.2)
SNSR.2: Rat Social Box Extension (CN4.9), Sensor (CN12.2)
SNSR.3: Rat Social Box Extension (CN4.7), Sensor (CN13.2)